# Altium schematic sheet Main_Roll.SchDoc
size A2; DocumentNumber: 1; SheetNumber: 1; SheetTotal: 1; SheetName: Main
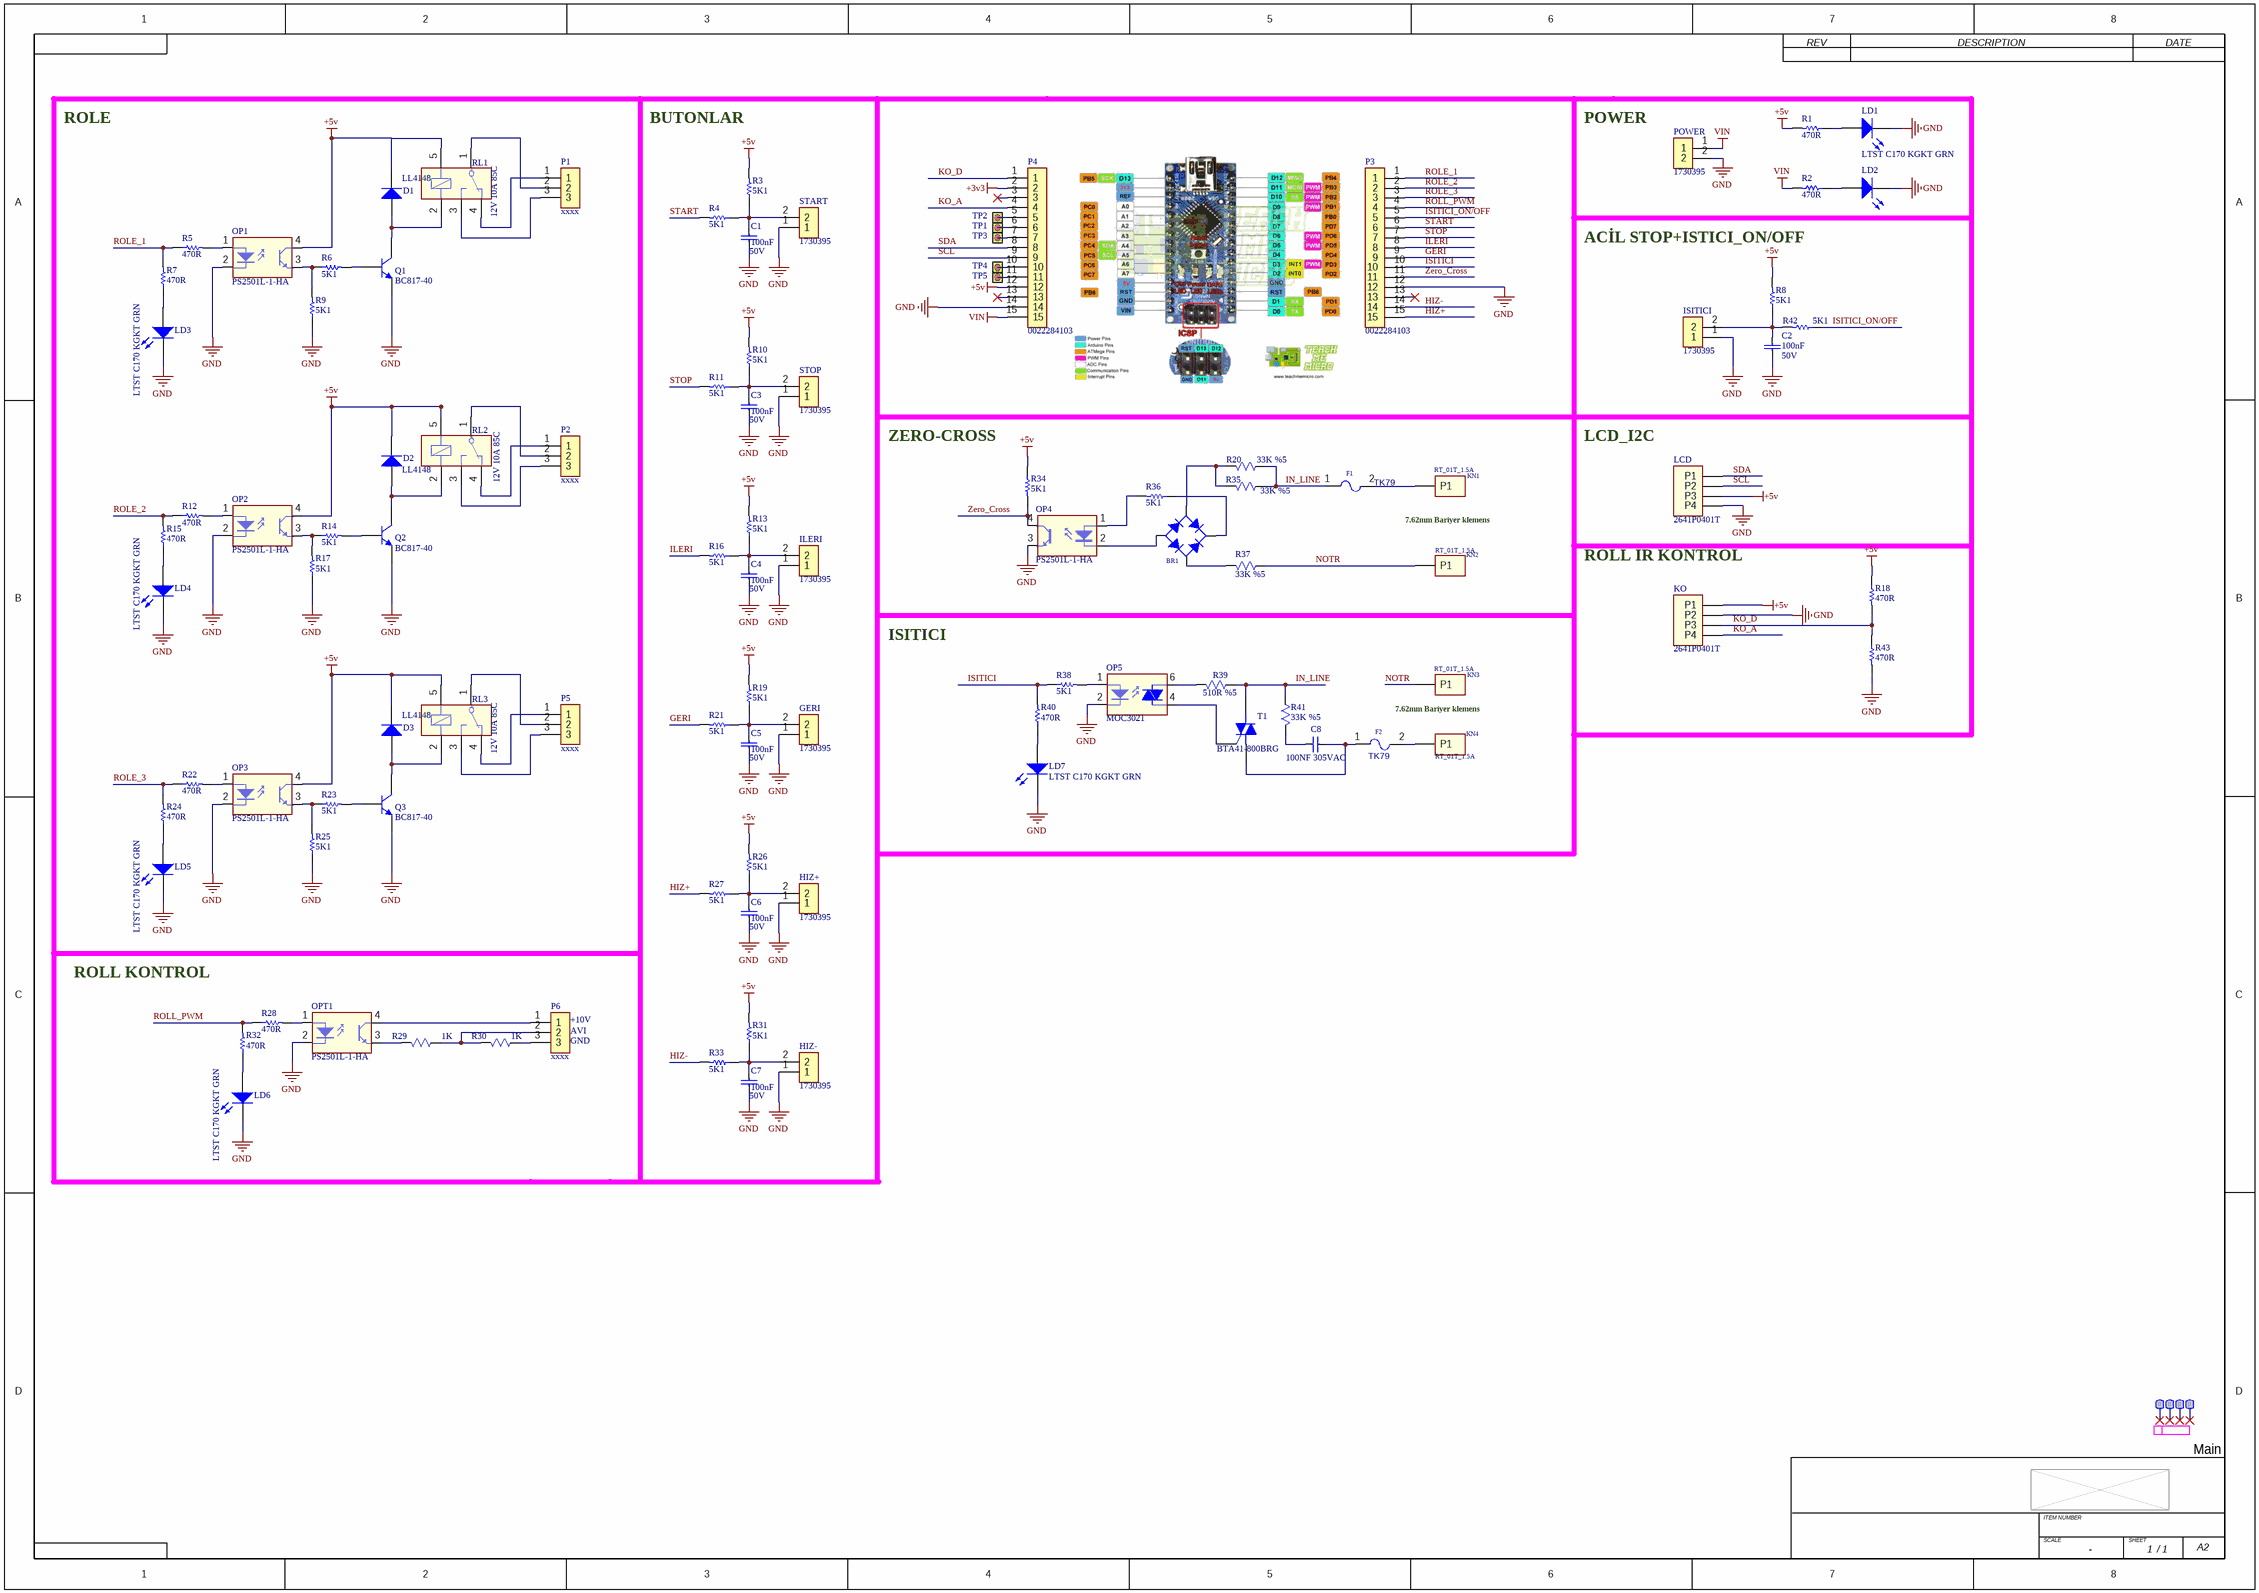
[diagram p0: Main_Roll.SchDoc]

## Parts
BR1  (no value)  [TO-269AA]
C1  100nF  Initial Voltage: 50V  [C1206]
C2  100nF  Initial Voltage: 50V  [C1206]
C3  100nF  Initial Voltage: 50V  [C1206]
C4  100nF  Initial Voltage: 50V  [C1206]
C5  100nF  Initial Voltage: 50V  [C1206]
C6  100nF  Initial Voltage: 50V  [C1206]
C7  100nF  Initial Voltage: 50V  [C1206]
C8  100NF 305VAC  [CFR F15 L18 B6 H12]
D1  LL4148  [SOD80]
D2  LL4148  [SOD80]
D3  LL4148  [SOD80]
ETİKET1  Etiket  [ETIKET]  (value not drawn)  (no BOM)
F1  TK79  [TK 79]
F2  TK79  [TK 79]
GERI  1730395  [1730395]
HIZ+  1730395  [1730395]
HIZ-  1730395  [1730395]
ILERI  1730395  [1730395]
ISITICI  1730395  [1730395]
KN1  RT_01T_1.5A  [RT_01T_1.5A]
KN2  RT_01T_1.5A  [RT_01T_1.5A]
KN3  RT_01T_1.5A  [RT_01T_1.5A]
KN4  RT_01T_1.5A  [RT_01T_1.5A]
KO  2641P0401T  [35312_4]
LCD  2641P0401T  [35312_4]
LD1  LTST C170 KGKT GRN  [LED0805 GRN]
LD2  LTST C170 KGKT GRN  [LED0805 GRN]  (value not drawn)
LD3  LTST C170 KGKT GRN  [LED0805 GRN]
LD4  LTST C170 KGKT GRN  [LED0805 GRN]
LD5  LTST C170 KGKT GRN  [LED0805 GRN]
LD6  LTST C170 KGKT GRN  [LED0805 GRN]
LD7  LTST C170 KGKT GRN  [LED0805 GRN]
OP1  PS2501L-1-HA  [DIP4SMD]
OP2  PS2501L-1-HA  [DIP4SMD]
OP3  PS2501L-1-HA  [DIP4SMD]
OP4  PS2501L-1-HA  [DIP4SMD]
OP5  MOC3021  [DIP6]
OPT1  PS2501L-1-HA  [DIP4SMD]
P1  xxxx  [5.08_3pin]
P2  xxxx  [5.08_3pin]
P3  0022284103  [HDR1X15]
P4  0022284103  [HDR1X15]
P5  xxxx  [5.08_3pin]
P6  xxxx  [5.08_3pin]
POWER  1730395  [1730395]
Q1  BC817-40  [SOT23]
Q2  BC817-40  [SOT23]
Q3  BC817-40  [SOT23]
R1  470R  [R1206]
R2  470R  [R1206]
R3  5K1  [R1206]
R4  5K1  [R1206]
R5  470R  [R1206]
R6  5K1  [R1206]
R7  470R  [R1206]
R8  5K1  [R1206]
R9  5K1  [R1206]
R10  5K1  [R1206]
R11  5K1  [R1206]
R12  470R  [R1206]
R13  5K1  [R1206]
R14  5K1  [R1206]
R15  470R  [R1206]
R16  5K1  [R1206]
R17  5K1  [R1206]
R18  470R  [R1206]
R19  5K1  [R1206]
R20  33K %5  [RCA0516]
R21  5K1  [R1206]
R22  470R  [R1206]
R23  5K1  [R1206]
R24  470R  [R1206]
R25  5K1  [R1206]
R26  5K1  [R1206]
R27  5K1  [R1206]
R28  470R  [R1206]
R29  33K %5  [RCA0516]  (value not drawn)
R30  33K %5  [RCA0516]  (value not drawn)
R31  5K1  [R1206]
R32  470R  [R1206]
R33  5K1  [R1206]
R34  5K1  [R1206]
R35  33K %5  [RCA0516]
R36  5K1  [R1206]
R37  33K %5  [RCA0516]
R38  5K1  [R1206]
R39  510R %5  [RCA0411]
R40  470R  [R1206]
R41  33K %5  [RCA0516]
R42  5K1  [R1206]
R43  470R  [R1206]
RL1  12V 10A 85C  [JS1]
RL2  12V 10A 85C  [JS1]
RL3  12V 10A 85C  [JS1]
START  1730395  [1730395]
STOP  1730395  [1730395]
T1  BTA41-800BRG  [TO247AC]
TP1  Test Point  [TESTPIN]  (value not drawn)
TP2  Test Point  [TESTPIN]  (value not drawn)
TP3  Test Point  [TESTPIN]  (value not drawn)
TP4  Test Point  [TESTPIN]  (value not drawn)
TP5  Test Point  [TESTPIN]  (value not drawn)
VD1  Vida 3mm  [Vida 3mm]  (value not drawn)  (no BOM)
VD2  Vida 3mm  [Vida 3mm]  (value not drawn)  (no BOM)
VD3  Vida 3mm  [Vida 3mm]  (value not drawn)  (no BOM)
VD4  Vida 3mm  [Vida 3mm]  (value not drawn)  (no BOM)

## Nets
+3v3: P4.2
+5v: D1.1(K) D2.1(K) D3.1(K) KO.1(P1) LCD.3(P3) OP1.4(C) OP2.4(C) OP3.4(C) P4.12 R1.2 R3.2 R8.2 R10.2 R13.2 R18.1 R19.2 R26.2 R31.2 R34.1 RL1.5(L2) RL2.5(L2) RL3.5(L2)
GND: C1.1 C2.1 C3.1 C4.1 C5.1 C6.1 C7.1 GERI.1 HIZ+.1 HIZ-.1 ILERI.1 ISITICI.1 KO.2(P2) LCD.4(P4) LD1.1(K) LD2.1(K) LD3.1(K) LD4.1(K) LD5.1(K) LD6.1(K) LD7.1(K) OP1.2(K) OP2.2(K) OP3.2(K) OP4.3(E) OP5.2(K) OPT1.2(K) P3.12 P4.14 POWER.2 Q1.2(E) Q2.2(E) Q3.2(E) R9.1 R17.1 R25.1 R43.2 START.1 STOP.1
VIN: P4.15 POWER.1 R2.2
GERI: P3.9 R21.2
HIZ+: P3.15 R27.2
HIZ-: P3.14 R33.2
ILERI: P3.8 R16.2
IN_LINE: F1.1(A) R20.2(B) R35.2(B) R39.2(B) R41.2(B) T1.2(A2)
ISITICI: P3.10 R38.1 R40.2
ISITICI_ON/OFF: P3.5 R42.1
KO_A: KO.4(P4) P4.4
KO_D: KO.3(P3) P4.1 R18.2 R43.1
NOTR: KN2.1(P1) KN3.1(P1) R37.2(B)
ROLE_1: P3.1 R5.1 R7.2
ROLE_2: P3.2 R12.1 R15.2
ROLE_3: P3.3 R22.1 R24.2
ROLL_PWM: P3.4 R28.1 R32.2
SCL: LCD.2(P2) P4.9
SDA: LCD.1(P1) P4.8
START: P3.6 R4.2
STOP: P3.7 R11.2
Zero_Cross: OP4.4(C) P3.11 R34.2
NetBR1_1: BR1.1(C) R20.1(A) R35.1(A)
NetBR1_2: BR1.2(C) R37.1(A)
NetBR1_3: BR1.3(K) R36.1
NetBR1_4: BR1.4(A) OP4.2(K)
NetC1_2: C1.2 R3.1 R4.1 START.2
NetC2_2: C2.2 ISITICI.2 R8.1 R42.2
NetC3_2: C3.2 R10.1 R11.1 STOP.2
NetC4_2: C4.2 ILERI.2 R13.1 R16.1
NetC5_2: C5.2 GERI.2 R19.1 R21.1
NetC6_2: C6.2 HIZ+.2 R26.1 R27.1
NetC7_2: C7.2 HIZ-.2 R31.1 R33.1
NetC8_1: C8.1 F2.1(A) T1.1(A1)
NetC8_2: C8.2 R41.1(A)
NetD1_2: D1.2(A) Q1.3(C) RL1.2(L1)
NetD2_2: D2.2(A) Q2.3(C) RL2.2(L1)
NetD3_2: D3.2(A) Q3.3(C) RL3.2(L1)
NetF1_2: F1.2(B) KN1.1(P1)
NetF2_2: F2.2(B) KN4.1(P1)
NetLD1_2: LD1.2(A) R1.1
NetLD2_2: LD2.2(A) R2.1
NetLD3_2: LD3.2(A) R7.1
NetLD4_2: LD4.2(A) R15.1
NetLD5_2: LD5.2(A) R24.1
NetLD6_2: LD6.2(A) R32.1
NetLD7_2: LD7.2(A) R40.1
NetOP1_1: OP1.1(A) R5.2
NetOP1_3: OP1.3(E) R6.1 R9.2
NetOP2_1: OP2.1(A) R12.2
NetOP2_3: OP2.3(E) R14.1 R17.2
NetOP3_1: OP3.1(A) R22.2
NetOP3_3: OP3.3(E) R23.1 R25.2
NetOP4_1: OP4.1(A) R36.2
NetOP5_1: OP5.1(A) R38.2
NetOP5_4: OP5.4(E) T1.3(G)
NetOP5_6: OP5.6(C) R39.1(A)
NetOPT1_1: OPT1.1(A) R28.2
NetOPT1_3: OPT1.3(E) R29.1(A)
NetOPT1_4: OPT1.4(C) P6.1
NetP1_1: P1.1 RL1.4(NC)
NetP1_2: P1.2 RL1.1(C)
NetP1_3: P1.3 RL1.3(NO)
NetP2_1: P2.1 RL2.4(NC)
NetP2_2: P2.2 RL2.1(C)
NetP2_3: P2.3 RL2.3(NO)
NetP4_5: P4.5 TP2.1
NetP4_6: P4.6 TP1.1
NetP4_7: P4.7 TP3.1
NetP4_10: P4.10 TP4.1
NetP4_11: P4.11 TP5.1
NetP5_1: P5.1 RL3.4(NC)
NetP5_2: P5.2 RL3.1(C)
NetP5_3: P5.3 RL3.3(NO)
NetP6_2: P6.2 R29.2(B) R30.1(A)
NetP6_3: P6.3 R30.2(B)
NetQ1_1: Q1.1(B) R6.2
NetQ2_1: Q2.1(B) R14.2
NetQ3_1: Q3.1(B) R23.2

Not connected (* = marked no-connect by the designer): P3 13*; P4 3* 13*; VD1 0*; VD2 0*; VD3 0*; VD4 0*

## Notes on the sheet
- ROLE
- BUTONLAR
- POWER
- ACİL STOP+ISTICI_ON/OFF
- ZERO-CROSS
- LCD_I2C
- 7.62mm Bariyer klemens
- ROLL IR KONTROL
- ISITICI
- ROLL KONTROL
- (near R29) 1K
- (near R30) 1K
- (near P6) +10V
- (near P6) AVI
- (near P6) GND
- REV
- DESCRIPTION
- DATE
- ITEM NUMBER
- SCALE
- -
- SHEET
- /
- A2

## Library data of the parts
BR1 = MB6S: Part Number: MB6S; Value: MB6S
C1-C7 = EL1581-0015: CAPACITOR, CERAMIC, 100nF, 50V, 10% TOLERANCE, X7R, 1206 PACKAGE; Manufacturer: AVX; RS_PLM_Stock: VI-00023353; ESP: ESP-1000-157; Man Code: 12065C104K4T2A; RS Stock Code: EL1581-0015; Thermal Stability: X7R; Component Type: Standard; Tolerance: 10%; Type: CERAMIC; Value: 100nF; Footprint: 1206
C8 = CFR15 100NF 305VAC M85 X2: SapStokKodu: 1200920408; Malzeme Tanımı: CAP T X2 100n 305V%10 F15; Part Number: CFR15 100NF 305VAC M85 X2; Value: 100NF 305VAC
D1-D3 = 1N4148-S: Malzeme Tanımı: DIODE SWITCHING SM 75V 150mA LLN4148; SAPStokKodu: 1200980003; Part Number: 1N4148-S; Value: LL4148
F1 F2 = FUSE TK79: Part Number: FUSE TK79; Value: TK79
GERI HIZ+ HIZ- ILERI ISITICI POWER START STOP = 00157666: CONN,RECT,PLUG,5.08MM,1ROW,2P-TH,1730395; Manufacturer: PHONEIX CONTACT; Contact Rating: 24A; ANGLE: VERTICAL; RS Stock Code: 00157666; RS_PLM_Stock: 00157666; Pin Count: 2; ESP: N/A; Man Code: 1730395; Component Type: Standard; PITCH: 5.08mm; TYPE: TH; Contact Gender: SOKET
KN1-KN4 = RT_01T_1.5A: SAPStokKodu: 1200950950; Malzeme Tanımı: PIN HEADER d1,5mm L15.5 RT 01T 1.5A; Part Number: RT_01T_1.5A; Value: RT_01T_1.5A
KO LCD = 2641P0401T: SAPStokKodu: 1200950842; Malzeme Tanımı: KONN 2.50mm 4'LU DIK 2641P0401T-1; Part Number: 2641P0401T; Value: 2641P0401T
LD1-LD7 = LTST C170 KGKT GRN: SAPStokKodu: 1200960005; Malzeme Tanımı: LED 0805 GREEN 35mcd 571nm AlInGaP; Part Number: LTST C170 KGKT GRN; Value: LTST C170 KGKT GRN
OP1-OP4 OPT1 = PS2501-1-H: Malzeme Tanımı: OPTOCOUP SM PS2501L-1-HA CTR=80-160; SAPStokKodu: 1200980477; Part Number: PS2501-1-H; Value: PS2501L-1-HA
OP5 = MOC3021: Malzeme Tanımı: OPTO TH TRIAC 3021; SAPStokKodu: 1200980258; Part Number: MOC3021; Value: MOC3021
P1 P2 P5 P6 = xx1: CONN,RECT,PLUG,5.08MM,1ROW,3P-TH,xxx; Manufacturer: PHONEIX CONTACT; RS_PLM_Stock: xx1; Contact Rating: 24A; ANGLE: VERTICAL; RS Stock Code: xx1; Pin Count: 2; ESP: N/A; Man Code: xxxx; Component Type: Standard; PITCH: 5.08mm; TYPE: TH; Contact Gender: SOKET; HelpURL: https://docs.arduino.cc/resources/schematics/A0000
P3 P4 = xx2: CONN, 2.54MM PITCH, THROUGH HOLE, SINGLE ROW, VERTICAL, 15 PIN, PIN,; Manufacturer: MOLEX; RS_PLM_Stock: xx2; ESP: DOC-00016411; Contact Rating: 3A; RS Stock Code: xx2; Pin Count: 15; Man Code: 0022284103; Component Type: Standard; PITCH: 2.54mm; TYPE: TH; ANGLE: VERTICAL; HelpURL: ‪D:\Datasheets\ssw\ssw-1xx-xx-xxx-x-xx-xxx-xx-mkt.pdf; Contact Gender: PIN
Q1-Q3 = BC817-40: Malzeme Tanımı: TRANS SM NPN BC817-40 SOT-23; SAPStokKodu: 1200980331; Part Number: BC817-40; Value: BC817-40
R1 R2 R5 R7 R12 R15 R18 R22 R24 R28 R32 R40 R43 = EL1591-0051: RESISTOR , 470R, 0.25W, 1%, 1206 PACKAGE; Manufacturer: MULTICOMP; Assy: True; RS_PLM_Stock: VI-00023486; ESP: ESP-1000-167; Man Code: MC025W12061470R; RS Stock Code: EL1591-0051; Component Type: Standard; Tolerance: 1%; Power Rating: 0.25W; Value: 470R; Footprint: 1206
R3 R4 R6 R8-R11 R13 R14 R16 R17 R19 R21 R23 R25-R27 R31 R33 R34 R36 R38 R42 = EL1591-0038: RESISTOR , 5K1, 1/4W, 1%, 1206 PACKAGE; Manufacturer: ROYALOHM; Assy: True; RS_PLM_Stock: VI-00023479; ESP: ESP-1000-167; Man Code: 1206S4F5101T5E; Power Rating: 0.125W; RS Stock Code: EL1591-0038; Component Type: Standard; Tolerance: 1%; Value: 5K1; Footprint: 1206
R20 R29 R30 R35 R37 R41 = RCA0516 33K %5 2W SS: SapStokKodu: 1200970666; Malzeme Tanımı: RES AXIAL CARB 33K %5 2W SSZ; Part Number: RCA0516 33K %5 2W SS; Value: 33K %5
R39 = RCA0411 510R %5 1W: SapStokKodu: 1200970285; Malzeme Tanımı: RES AXIAL CARB 510R %5 1W; Value: 510R %5; Part Number: RCA0411 510R %5 1W
RL1-RL3 = JS1 B 12V 10A 85C: SAPStokKodu: 1200930032; Malzeme Tanımı: RELAY SPDT 12V 10A 16x22x16mm; Part Number: JS1 B 12V 10A 85C; Value: 12V 10A 85C
T1 = XXX: BTA41; Manufacturer: STMicroelectronics; RS_PLM_Stock: XXX; RS Stock Code: XXX; Man Code: BTA41-800BRG; Component Type: Standard
TP1-TP5 = TESTPIN: Part Number: TESTPIN
VD1-VD4 = Vida3mm: RS Stock Code: Vida3mm; Component Type: Mechanical; RS_PLM_Stock: Vida3mm
ETİKET1 = Etiket: RS Stock Code: Etiket; Component Type: Mechanical; RS_PLM_Stock: Etiket